# EAGLE design EtnaNode1.0 (EAGLE 7.2.0)
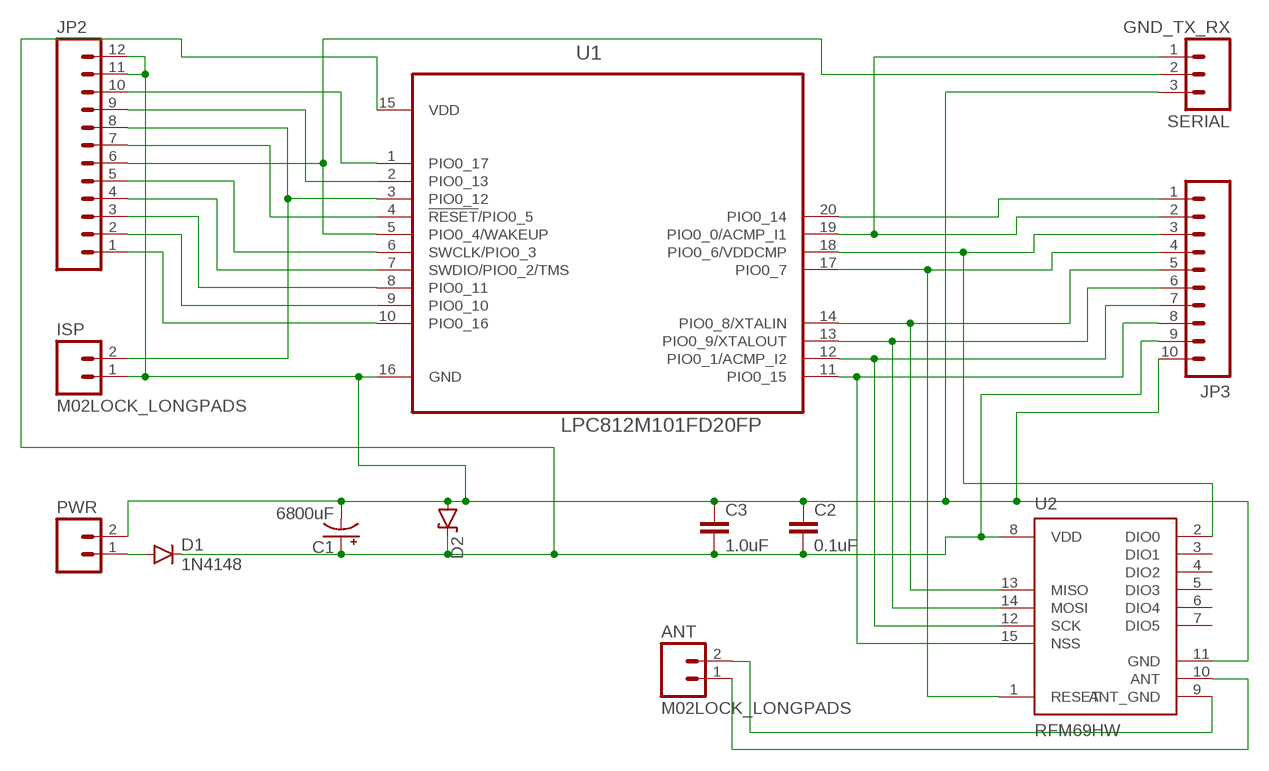
[diagram p0: schematic, sheet 1]

## Parts
ANT  M02LOCK_LONGPADS  [1X02_LOCK_LONGPADS]
C1  6800uF  CAP_POLPTH4  [CPOL-RADIAL-1000UF-25V]
C2  0.1uF  CAPPTH  [CAP-PTH-SMALL]
C3  1.0uF  CAPPTH  [CAP-PTH-SMALL]
D1  1N4148  DIODE1N4148  [DIODE-1N4148]
D2  DIODE-ZENERPTH  [DIODE-ZENER]
ISP  M02LOCK_LONGPADS  [1X02_LOCK_LONGPADS]
JP2  M12LOCK_LONGPADS  [1X12_LOCK_LONGPADS]
JP3  M10LOCK_LONGPADS  [1X10_LOCK_LONGPADS]
PWR  M02LOCK_LONGPADS  [1X02_LOCK_LONGPADS]
SERIAL  GND_TX_RX  M03LOCK_LONGPADS  [1X03_LOCK_LONGPADS]
U1  LPC812M101FD20FP  [SOIC127P1032X265-20N]
U2  RFM69HW  [RFM69W-XXXS2]

## Nets
ANT_GND: ANT.2 U2.9(ANT_GND)
GND: C1.- C2.1 C3.1 D2.P$2(A) ISP.1 JP2.11 JP2.12(VCC) JP3.10 PWR.2 SERIAL.3(U0_RXD) U1.16(GND) U2.11(GND)
N$1: D1.A PWR.1
N$4: JP3.2 SERIAL.1(GND) U1.19(PIO0_0/ACMP_I1)
N$5: JP2.6 SERIAL.2(U0_TXD) U1.5(PIO0_4/WAKEUP)
N$6: ISP.2 JP2.8 U1.3(PIO0_12)
N$7: JP3.5 U1.14(PIO0_8/XTALIN) U2.13(MISO)
N$8: JP3.6 U1.13(PIO0_9/XTALOUT) U2.14(MOSI)
N$9: JP3.7 U1.12(PIO0_1/ACMP_I2) U2.12(SCK)
N$10: JP3.8 U1.11(PIO0_15) U2.15(NSS)
N$11: JP3.4 U1.17(PIO0_7) U2.1(RESET)
N$12: JP3.3 U1.18(PIO0_6/VDDCMP) U2.2(DIO0)
N$13: JP2.1 U1.10(PIO0_16)
N$14: JP2.2 U1.9(PIO0_10)
N$15: JP2.3 U1.8(PIO0_11)
N$16: JP2.4 U1.7(SWDIO/PIO0_2/TMS)
N$17: JP2.5 U1.6(SWCLK/PIO0_3)
N$18: JP2.7 U1.4(!RESET!/PIO0_5)
N$19: JP2.9 U1.2(PIO0_13)
N$20: JP2.10 U1.1(PIO0_17)
N$21: JP3.1 U1.20(PIO0_14)
N$22: ANT.1 U2.10(ANT)
VDD: C1.+ C2.2 C3.2 D1.C D2.P$1(C) JP3.9 U1.15(VDD) U2.8(VDD)
Unconnected: U2.3(DIO1) U2.4(DIO2) U2.5(DIO3) U2.6(DIO4) U2.7(DIO5)

## Library data of the parts
ANT ISP PWR = SparkFun-Connectors:M02: Standard 2-pin 0.1" header. Use with - straight break away headers ( PRT-00116) - right angle break away headers (PRT-00553) - swiss pins (PRT-00743) - machine pins (PRT-00117) - female headers (PRT-00115) Molex polarized connector foot print use with: PRT-08233 with associated crimp pins and housings. 2.54_SCREWTERM for use with PRT-10571. 3.5mm Screw Terminal footprints for PRT-08084 5mm Screw Terminal footprints for use with PRT-08432
C1 = SparkFun-Capacitors:CAP_POL: Capacitor Polarized These are standard SMD and PTH capacitors. Normally 10uF, 47uF, and 100uF in electrolytic and tantalum varieties. Always verify the external diameter of the through hole cap, it varies with capacity, voltage, and manufacturer. The EIA devices should be standard.
C2 C3 = SparkFun-Capacitors:CAP: Capacitor Standard 0603 ceramic capacitor, and 0.1" leaded capacitor.
D1 = SparkFun-DiscreteSemi:DIODE: Diode These are standard reverse protection diodes and small signal diodes. SMA package can handle up to about 1A. SOD-323 can handle about 200mA. What the SOD-323 package when ordering, there are some mfgs out there that are 5-pin packages.
D2 = SparkFun-DiscreteSemi:DIODE-ZENER: Zener Diode Production Part - 8199 3.4V Zener Voltage
JP2 = SparkFun-Connectors:M12: Header 12 Standard 12-pin 0.1" header. Use with straight break away headers (SKU : PRT-00116), right angle break away headers (PRT-00553), swiss pins (PRT-00743), machine pins (PRT-00117), and female headers (PRT-00115).
JP3 = SparkFun-Connectors:M10: Header 10 Standard 10-pin 0.1" header. Use with straight break away headers (SKU : PRT-00116), right angle break away headers (PRT-00553), swiss pins (PRT-00743), machine pins (PRT-00117), and female headers (PRT-00115).
SERIAL = SparkFun-Connectors:M03: Header 3 Standard 3-pin 0.1" header. Use with straight break away headers (SKU : PRT-00116), right angle break away headers (PRT-00553), swiss pins (PRT-00743), machine pins (PRT-00117), and female headers (PRT-00115). Molex polarized connector foot print use with SKU : PRT-08232 with associated crimp pins and housings.
U1 = lpc812:LPC812M101FD20FP: IC, 32-bit ARM Cortex-M0+ microcontroller 16 kB flash and 4 kB SRAM, SO20; MPN: LPC812M101FD20FP; OC_FARNELL: 2295531; OC_NEWARK: 69W0666; PACKAGE: SO20; SUPPLIER: NXP
U2 = SparkFun-RF:RFM69H

## Board
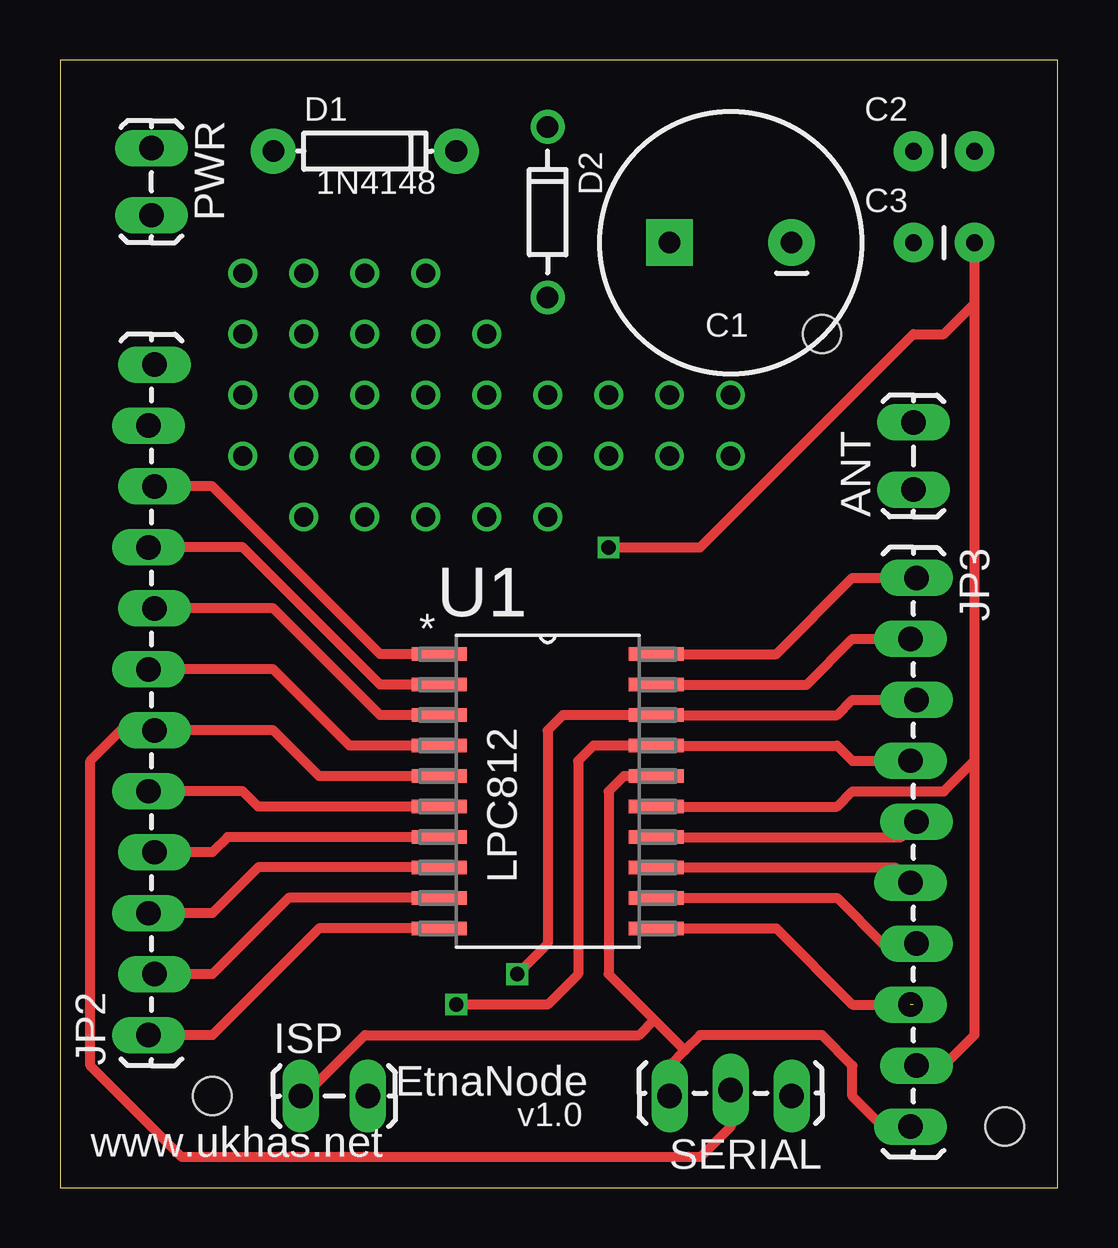
[diagram p1: board, top side]
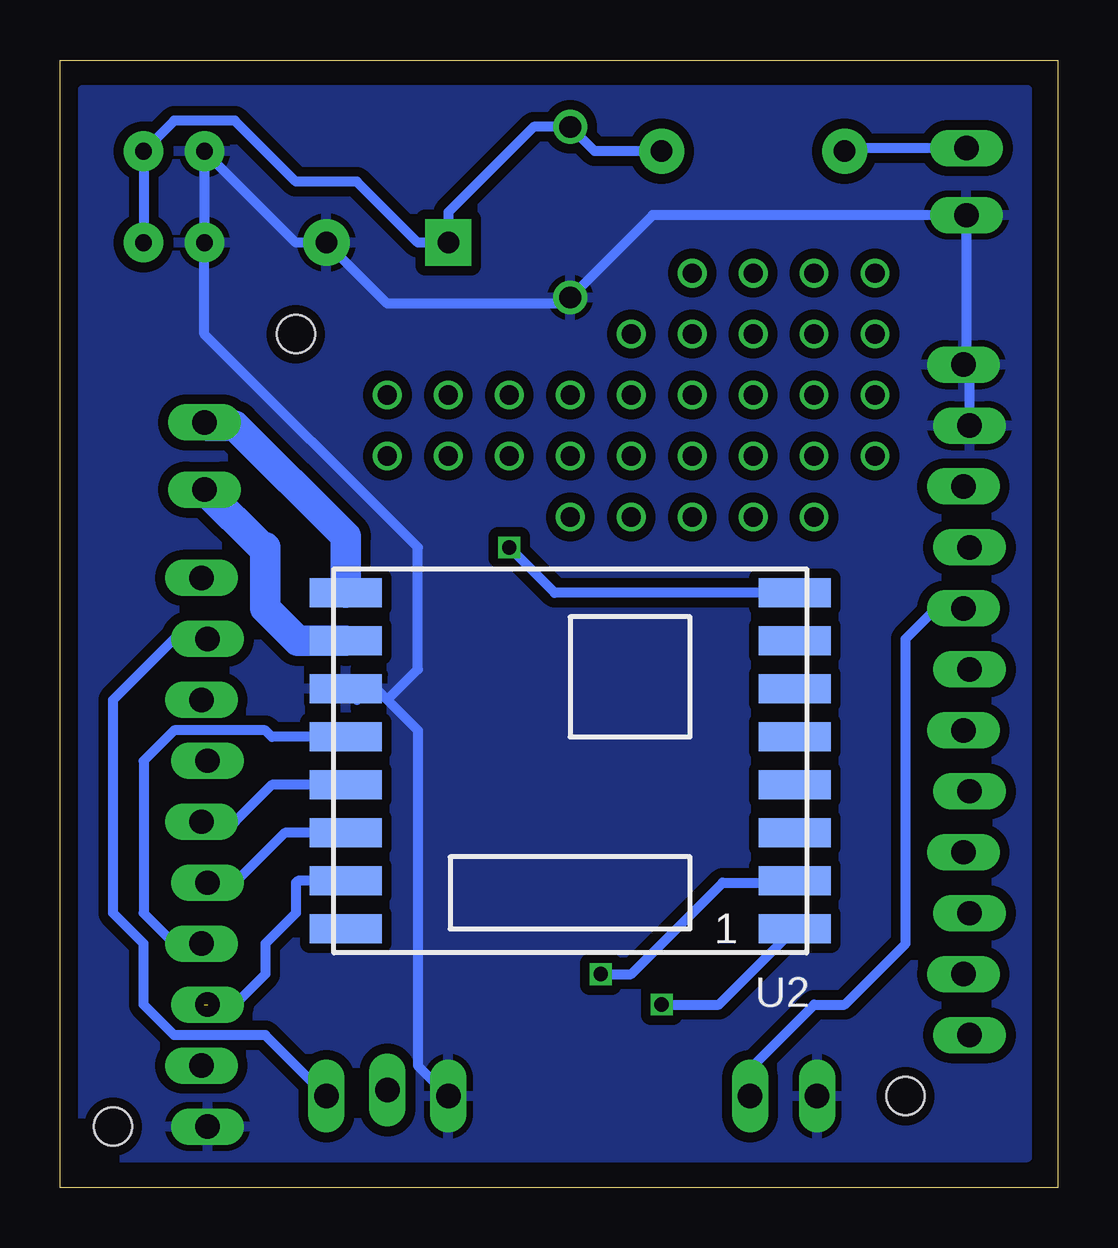
[diagram p2: board, bottom side, seen from below]

Size 41.58 x 46.98 mm. Coordinates in mm from the lower left corner, seen from the top.
Outline: 0,0 41.58,0 41.58,46.98 0,46.98 0,0
Copper layers (1*16): Top 0.035mm / dielectric 1.5mm / Bottom 0.035mm
Design rules "hackvana": minimum track width 6mil, minimum drill 0.3mm, track to track 6mil, track to pad 6mil, pad to pad 6mil, via to via 6mil, smd to smd 0mil, copper to edge 6mil, drill to drill 6mil, minimum pad ring 10mil, minimum via ring 6mil, stop-mask expansion 2mil, vias tented up to drill 100mil, thermal gap 10mil
Holes 1.6 mm at 6.35,3.81 39.37,2.54 31.75,35.56

### Footprints (pad centres in the part's own frame; a part is rotated, then mirrored left to right if it is on the bottom)
1X02_LOCK_LONGPADS = drill 1.016 long: 1 -0.127,0; 2 2.667,0
CPOL-RADIAL-1000UF-25V = drill 0.9 pad 1.93 square: + 2.54,0 | drill 0.9 pad 1.93: - -2.54,0
CAP-PTH-SMALL = drill 0.7 pad 1.651: 1 0,0; 2 2.54,0
DIODE-1N4148 = drill 0.9 pad 1.88: A -3.81,0; C 3.81,0
DIODE-ZENER = drill 0.9: P$1 -3.556,0; P$2 3.556,0
1X12_LOCK_LONGPADS = drill 1.016 long: 1 0,0.127; 2 2.54,-0.127; 3 5.08,0.127; 4 7.62,-0.127; 5 10.16,0.127; 6 12.7,-0.127; 7 15.24,0.127; 8 17.78,-0.127; 9 20.32,0.127; 10 22.86,-0.127; 11 25.4,0.127; 12 27.94,-0.127
1X10_LOCK_LONGPADS = drill 1.016 long: 1 0,0.127; 2 2.54,-0.127; 3 5.08,0.127; 4 7.62,-0.127; 5 10.16,0.127; 6 12.7,-0.127; 7 15.24,0.127; 8 17.78,-0.127; 9 20.32,0.127; 10 22.86,-0.127
1X03_LOCK_LONGPADS = drill 1.016 long: 1 0,0; 2 2.54,-0.254; 3 5.08,0
SOIC127P1032X265-20N = smd 2.286 x 0.559: 1 -4.521,5.715; 2 -4.521,4.445; 3 -4.521,3.175; 4 -4.521,1.905; 5 -4.521,0.635; 6 -4.521,-0.635; 7 -4.521,-1.905; 8 -4.521,-3.175; 9 -4.521,-4.445; 10 -4.521,-5.715; 11 4.521,-5.715; 12 4.521,-4.445; 13 4.521,-3.175; 14 4.521,-1.905; 15 4.521,-0.635; 16 4.521,0.635; 17 4.521,1.905; 18 4.521,3.175; 19 4.521,4.445; 20 4.521,5.715
RFM69W-XXXS2 = smd 3 x 1.2: 1 -9.35,7; 2 -9.35,5; 3 -9.35,3; 4 -9.35,1; 5 -9.35,-1; 6 -9.35,-3; 7 -9.35,-5; 8 -9.35,-7; 9 9.35,-7; 10 9.35,-5; 11 9.35,-3; 12 9.35,-1; 13 9.35,1; 14 9.35,3; 15 9.35,5; 16 9.35,7

### Placement (x,y rotation side)
ANT  35.56,29.21 90 top
C1  27.94,39.37 180 top
C2  35.56,43.18 0 top
C3  35.56,39.37 0 top
D1  12.7,43.18 0 top
D2  20.32,40.64 270 top
ISP  10.16,3.81 0 top
JP2  3.81,6.35 90 top
JP3  35.56,25.4 270 top
PWR  3.81,43.18 270 top
SERIAL  30.48,3.81 180 top
U1  20.32,16.51 0 top
U2  20.32,17.78 180 bottom

### Tracks (layer width: path | path; a pad name or v marks a point on that pad's centre or on a via)
ANT_GND
  Bottom 1.27: U2.9 29.67,27.13 34.29,31.75 35.43,31.75 ANT.2
GND
  Top 0.406: JP3.10 34.29,2.54 33.02,3.81 33.02,5.08 31.75,6.35 26.67,6.35 26.04,5.71 | 26.04,5.71 25.4,5.08 SERIAL.3 | U1.16 23.5,17.14 22.86,16.51 22.86,8.89 24.77,6.99 | 24.77,6.99 26.04,5.71 | ISP.1 10.16,3.81 12.7,6.35 24.13,6.35 24.77,6.99
  Bottom 0.406: JP2.11 3.68,34.04 JP2.12 3.81,34.42 PWR.2 16.89,40.51 D2.P$2 20.57,36.83 27.94,36.83 C1.- 31.75,39.37 C2.1 C3.1 35.56,35.56 26.67,26.67 26.67,21.59 27.94,20.32 | 29.21,20.32 U2.11 28.4,20.78 27.94,20.32 | 27.94,20.32 26.67,19.05 26.67,5.08 SERIAL.3
  pour Bottom (isolate 0.406): 1.27,45.72 40.64,45.72 40.64,1.27 1.27,1.27
N$1
  Bottom 0.406: PWR.1 8.89,43.31 D1.A
N$2  (via drill 0.8)
  other vias: 7.62,38.1
N$3  (via drill 0.8)
  other vias: 7.62,35.56
N$4
  Top 0.406: U1.19 31.11,20.95 33.02,22.86 JP3.2
  Bottom 0.406: JP3.2 36.83,22.86 39.37,20.32 39.37,11.43 38.1,10.16 38.1,7.62 36.83,6.35 33.02,6.35 SERIAL.1
N$5
  Top 0.406: U1.5 10.79,17.14 8.89,19.05 JP2.6 2.54,19.05 1.27,17.78 1.27,5.08 5.08,1.27 26.67,1.27 27.94,2.54 SERIAL.2
N$6
  Top 0.406: U1.3 13.34,19.68 8.89,24.13 JP2.8
  Bottom 0.406: ISP.2 12.83,4.95 10.16,7.62 8.89,7.62 6.35,10.16 6.35,22.86 5.08,24.13 JP2.8
N$7
  Top 0.406: U1.14 35.05,14.61 JP3.5
  Bottom 0.406: U2.13 32.75,16.78 34.29,15.24 JP3.5
N$8
  Top 0.406: U1.13 34.8,13.34 JP3.6
  Bottom 0.406: U2.14 32.21,14.78 34.29,12.7 JP3.6
N$9
  Top 0.406: U1.12 32.38,12.06 34.29,10.16 JP3.7
  Bottom 0.406: U2.12 32.75,18.78 33.02,19.05 36.83,19.05 38.1,17.78 38.1,11.43 36.83,10.16 JP3.7
N$10  (1 unrouted)
  Top 0.406: U1.11 29.84,10.79 33.02,7.62 35.56,7.62
  Bottom 0.406: U2.15 31.67,12.78 31.75,12.7 31.75,11.43 33.02,10.16 33.02,8.89 34.29,7.62 JP3.8
N$11  (via drill 0.6)
  Top 0.406: JP3.4 33.02,17.78 32.38,18.41 U1.17 22.23,18.41 21.59,17.78 21.59,8.89 20.32,7.62 v16.51,7.62
  Bottom 0.406: v16.51,7.62 14.13,7.62 U2.1
N$12  (via drill 0.6)
  Top 0.406: JP3.3 33.02,20.32 32.38,19.68 U1.18 20.95,19.68 20.32,19.05 20.32,10.16 v19.05,8.89
  Bottom 0.406: v19.05,8.89 17.78,8.89 13.97,12.7 11.05,12.7 U2.2
N$13
  Top 0.406: U1.10 10.79,10.79 6.35,6.35 JP2.1
N$14
  Top 0.406: U1.9 9.53,12.06 6.35,8.89 JP2.2
N$15
  Top 0.406: U1.8 8.26,13.34 6.35,11.43 JP2.3
N$16
  Top 0.406: U1.7 6.99,14.61 6.35,13.97 JP2.4
N$17
  Top 0.406: U1.6 8.26,15.88 7.62,16.51 JP2.5
N$18
  Top 0.406: U1.4 12.06,18.41 8.89,21.59 JP2.7
N$19
  Top 0.406: U1.2 13.34,20.95 7.62,26.67 JP2.9
N$20
  Top 0.406: U1.1 13.34,22.23 6.35,29.21 JP2.10
N$21
  Top 0.406: U1.20 29.84,22.23 33.02,25.4 JP3.1
N$22
  Bottom 1.27: U2.10 31.67,22.78 33.02,24.13 33.02,26.67 33.15,26.67 ANT.1
N$23  (via drill 0.8)
  other vias: 7.62,33.02
N$24  (via drill 0.8)
  other vias: 7.62,30.48
N$25  (via drill 0.8)
  other vias: 10.16,30.48
N$26  (via drill 0.8)
  other vias: 10.16,33.02
N$27  (via drill 0.8)
  other vias: 10.16,35.56
N$28  (via drill 0.8)
  other vias: 10.16,38.1
N$29  (via drill 0.8)
  other vias: 12.7,38.1
N$30  (via drill 0.8)
  other vias: 12.7,35.56
N$31  (via drill 0.8)
  other vias: 12.7,33.02
N$32  (via drill 0.8)
  other vias: 12.7,30.48
N$33  (via drill 0.8)
  other vias: 15.24,30.48
N$34  (via drill 0.8)
  other vias: 15.24,33.02
N$35  (via drill 0.8)
  other vias: 15.24,35.56
N$36  (via drill 0.8)
  other vias: 15.24,38.1
N$37  (via drill 0.8)
  other vias: 17.78,35.56
N$38  (via drill 0.8)
  other vias: 17.78,33.02
N$39  (via drill 0.8)
  other vias: 17.78,30.48
N$40  (via drill 0.8)
  other vias: 20.32,30.48
N$41  (via drill 0.8)
  other vias: 20.32,33.02
N$42  (via drill 0.8)
  other vias: 22.86,33.02
N$43  (via drill 0.8)
  other vias: 22.86,30.48
N$44  (via drill 0.8)
  other vias: 25.4,30.48
N$45  (via drill 0.8)
  other vias: 27.94,30.48
N$46  (via drill 0.8)
  other vias: 27.94,33.02
N$47  (via drill 0.8)
  other vias: 25.4,33.02
N$48  (via drill 0.8)
  other vias: 12.7,27.94
N$49  (via drill 0.8)
  other vias: 15.24,27.94
N$50  (via drill 0.8)
  other vias: 17.78,27.94
N$51  (via drill 0.8)
  other vias: 20.32,27.94
N$52  (via drill 0.8)
  other vias: 10.16,27.94
VDD  (via drill 0.6)
  Top 0.406: C3.2 38.1,36.83 | 38.1,36.83 38.1,17.78 | 38.1,17.78 38.1,6.35 36.83,5.08 JP3.9 | U1.15 32.38,15.88 33.02,16.51 36.83,16.51 38.1,17.78 | v22.86,26.67 26.67,26.67 35.56,35.56 36.83,35.56 38.1,36.83
  Bottom 0.406: D1.C 19.3,43.18 D2.P$1 21.84,44.2 25.4,40.64 C1.+ 26.67,39.37 29.21,41.91 31.75,41.91 34.29,44.45 36.83,44.45 C2.2 C3.2 | U2.8 20.97,24.78 v22.86,26.67

### Text on the board
tPlace: LPC812 | EtnaNode | v1.0 | www.ukhas.net